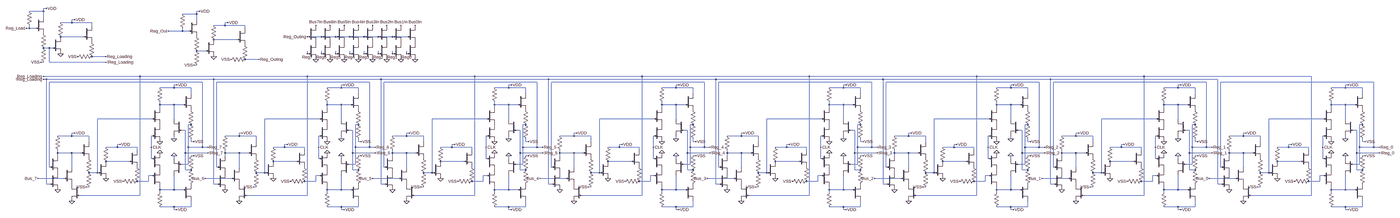
[diagram p0: schematic register_8bit.asc, whole sheet]
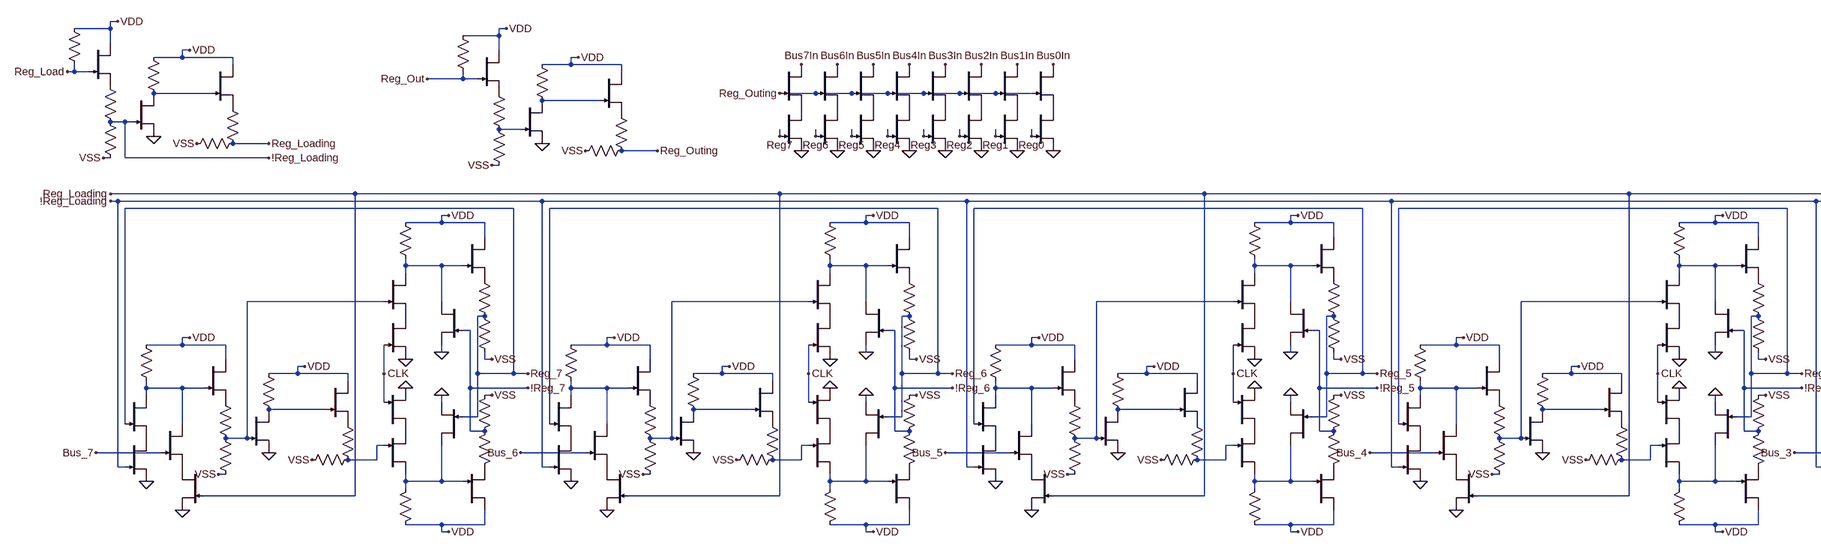
[diagram p1: schematic register_8bit.asc, part, row 1 of 1, column 1 of 2]
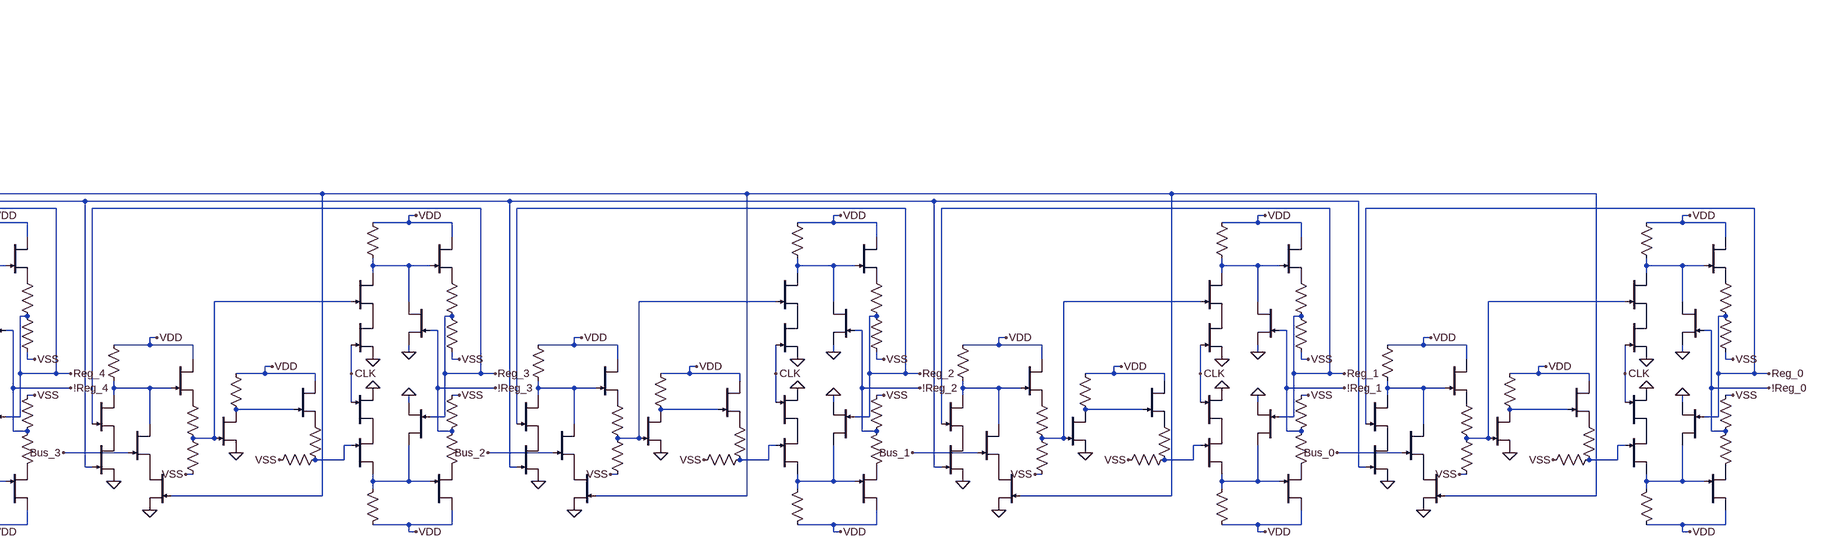
[diagram p2: schematic register_8bit.asc, part, row 1 of 1, column 2 of 2]
* register_8bit.asc
R1 VDD Reg_Load 100k
J_F1 VDD Reg_Load P001 DR
R2 P001 !Reg_Loading 1k
R3 !Reg_Loading VSS 4.8k
J_A1 N001 !Reg_Loading 0 DR
R4 VDD N001 50k
J_A2 VDD N001 P002 DR
R5 P002 Reg_Loading 1k
R6 Reg_Loading VSS 4.5k
R7 VDD Reg_Out 100k
J_F2 VDD Reg_Out P003 DR
R8 P003 N003 1k
R9 N003 VSS 4.8k
J_A3 N002 N003 0 DR
R10 VDD N002 50k
J_A4 VDD N002 P004 DR
R11 P004 Reg_Outing 1k
R12 Reg_Outing VSS 4.5k
J_A5 N004 N005 P005 DR
R13 VDD N004 100k
J_F3 VDD N004 P006 DR
R14 P006 Reg_7 1k
R15 Reg_7 VSS 4.8k
J_B1 N004 !Reg_7 0 DR
J_A6 N009 N008 P007 DR
R16 VDD N009 100k
J_F4 VDD N009 P008 DR
R17 P008 !Reg_7 1k
R18 !Reg_7 VSS 4.8k
J_B2 N009 Reg_7 0 DR
J_A7 P005 CLK 0 DR
J_A8 P007 CLK 0 DR
J_A9 N006 Reg_7 P009 DR
R19 VDD N006 100k
J_F5 VDD N006 P010 DR
R20 P010 N005 1k
R21 N005 VSS 4.8k
J_B3 N006 Bus_7 P011 DR
J_A10 N007 N005 0 DR
R22 VDD N007 50k
J_A11 VDD N007 P012 DR
R23 P012 N008 1k
R24 N008 VSS 4.5k
J_A12 P009 !Reg_Loading 0 DR
J_B4 P011 Reg_Loading 0 DR
J_A13 N010 N011 P013 DR
R25 VDD N010 100k
J_F6 VDD N010 P014 DR
R26 P014 Reg_6 1k
R27 Reg_6 VSS 4.8k
J_B5 N010 !Reg_6 0 DR
J_A14 N015 N014 P015 DR
R28 VDD N015 100k
J_F7 VDD N015 P016 DR
R29 P016 !Reg_6 1k
R30 !Reg_6 VSS 4.8k
J_B6 N015 Reg_6 0 DR
J_A15 P013 CLK 0 DR
J_A16 P015 CLK 0 DR
J_A17 N012 Reg_6 P017 DR
R31 VDD N012 100k
J_F8 VDD N012 P018 DR
R32 P018 N011 1k
R33 N011 VSS 4.8k
J_B7 N012 Bus_6 P019 DR
J_A18 N013 N011 0 DR
R34 VDD N013 50k
J_A19 VDD N013 P020 DR
R35 P020 N014 1k
R36 N014 VSS 4.5k
J_A20 P017 !Reg_Loading 0 DR
J_B8 P019 Reg_Loading 0 DR
J_A21 N016 N017 P021 DR
R37 VDD N016 100k
J_F9 VDD N016 P022 DR
R38 P022 Reg_5 1k
R39 Reg_5 VSS 4.8k
J_B9 N016 !Reg_5 0 DR
J_A22 N021 N020 P023 DR
R40 VDD N021 100k
J_F10 VDD N021 P024 DR
R41 P024 !Reg_5 1k
R42 !Reg_5 VSS 4.8k
J_B10 N021 Reg_5 0 DR
J_A23 P021 CLK 0 DR
J_A24 P023 CLK 0 DR
J_A25 N018 Reg_5 P025 DR
R43 VDD N018 100k
J_F11 VDD N018 P026 DR
R44 P026 N017 1k
R45 N017 VSS 4.8k
J_B11 N018 Bus_5 P027 DR
J_A26 N019 N017 0 DR
R46 VDD N019 50k
J_A27 VDD N019 P028 DR
R47 P028 N020 1k
R48 N020 VSS 4.5k
J_A28 P025 !Reg_Loading 0 DR
J_B12 P027 Reg_Loading 0 DR
J_A29 N022 N023 P029 DR
R49 VDD N022 100k
J_F12 VDD N022 P030 DR
R50 P030 Reg_4 1k
R51 Reg_4 VSS 4.8k
J_B13 N022 !Reg_4 0 DR
J_A30 N027 N026 P031 DR
R52 VDD N027 100k
J_F13 VDD N027 P032 DR
R53 P032 !Reg_4 1k
R54 !Reg_4 VSS 4.8k
J_B14 N027 Reg_4 0 DR
J_A31 P029 CLK 0 DR
J_A32 P031 CLK 0 DR
J_A33 N024 Reg_4 P033 DR
R55 VDD N024 100k
J_F14 VDD N024 P034 DR
R56 P034 N023 1k
R57 N023 VSS 4.8k
J_B15 N024 Bus_4 P035 DR
J_A34 N025 N023 0 DR
R58 VDD N025 50k
J_A35 VDD N025 P036 DR
R59 P036 N026 1k
R60 N026 VSS 4.5k
J_A36 P033 !Reg_Loading 0 DR
J_B16 P035 Reg_Loading 0 DR
J_A37 N028 N029 P037 DR
R61 VDD N028 100k
J_F15 VDD N028 P038 DR
R62 P038 Reg_3 1k
R63 Reg_3 VSS 4.8k
J_B17 N028 !Reg_3 0 DR
J_A38 N033 N032 P039 DR
R64 VDD N033 100k
J_F16 VDD N033 P040 DR
R65 P040 !Reg_3 1k
R66 !Reg_3 VSS 4.8k
J_B18 N033 Reg_3 0 DR
J_A39 P037 CLK 0 DR
J_A40 P039 CLK 0 DR
J_A41 N030 Reg_3 P041 DR
R67 VDD N030 100k
J_F17 VDD N030 P042 DR
R68 P042 N029 1k
R69 N029 VSS 4.8k
J_B19 N030 Bus_3 P043 DR
J_A42 N031 N029 0 DR
R70 VDD N031 50k
J_A43 VDD N031 P044 DR
R71 P044 N032 1k
R72 N032 VSS 4.5k
J_A44 P041 !Reg_Loading 0 DR
J_B20 P043 Reg_Loading 0 DR
J_A45 N034 N035 P045 DR
R73 VDD N034 100k
J_F18 VDD N034 P046 DR
R74 P046 Reg_2 1k
R75 Reg_2 VSS 4.8k
J_B21 N034 !Reg_2 0 DR
J_A46 N039 N038 P047 DR
R76 VDD N039 100k
J_F19 VDD N039 P048 DR
R77 P048 !Reg_2 1k
R78 !Reg_2 VSS 4.8k
J_B22 N039 Reg_2 0 DR
J_A47 P045 CLK 0 DR
J_A48 P047 CLK 0 DR
J_A49 N036 Reg_2 P049 DR
R79 VDD N036 100k
J_F20 VDD N036 P050 DR
R80 P050 N035 1k
R81 N035 VSS 4.8k
J_B23 N036 Bus_2 P051 DR
J_A50 N037 N035 0 DR
R82 VDD N037 50k
J_A51 VDD N037 P052 DR
R83 P052 N038 1k
R84 N038 VSS 4.5k
J_A52 P049 !Reg_Loading 0 DR
J_B24 P051 Reg_Loading 0 DR
J_A53 N040 N041 P053 DR
R85 VDD N040 100k
J_F21 VDD N040 P054 DR
R86 P054 Reg_1 1k
R87 Reg_1 VSS 4.8k
J_B25 N040 !Reg_1 0 DR
J_A54 N045 N044 P055 DR
R88 VDD N045 100k
J_F22 VDD N045 P056 DR
R89 P056 !Reg_1 1k
R90 !Reg_1 VSS 4.8k
J_B26 N045 Reg_1 0 DR
J_A55 P053 CLK 0 DR
J_A56 P055 CLK 0 DR
J_A57 N042 Reg_1 P057 DR
R91 VDD N042 100k
J_F23 VDD N042 P058 DR
R92 P058 N041 1k
R93 N041 VSS 4.8k
J_B27 N042 Bus_1 P059 DR
J_A58 N043 N041 0 DR
R94 VDD N043 50k
J_A59 VDD N043 P060 DR
R95 P060 N044 1k
R96 N044 VSS 4.5k
J_A60 P057 !Reg_Loading 0 DR
J_B28 P059 Reg_Loading 0 DR
J_A61 N046 N047 P061 DR
R97 VDD N046 100k
J_F24 VDD N046 P062 DR
R98 P062 Reg_0 1k
R99 Reg_0 VSS 4.8k
J_B29 N046 !Reg_0 0 DR
J_A62 N051 N050 P063 DR
R100 VDD N051 100k
J_F25 VDD N051 P064 DR
R101 P064 !Reg_0 1k
R102 !Reg_0 VSS 4.8k
J_B30 N051 Reg_0 0 DR
J_A63 P061 CLK 0 DR
J_A64 P063 CLK 0 DR
J_A65 N048 Reg_0 P065 DR
R103 VDD N048 100k
J_F26 VDD N048 P066 DR
R104 P066 N047 1k
R105 N047 VSS 4.8k
J_B31 N048 Bus_0 P067 DR
J_A66 N049 N047 0 DR
R106 VDD N049 50k
J_A67 VDD N049 P068 DR
R107 P068 N050 1k
R108 N050 VSS 4.5k
J_A68 P065 !Reg_Loading 0 DR
J_B32 P067 Reg_Loading 0 DR
J_BUS1 P069 Reg7 0 DR
J_BUS2 Bus7In Reg_Outing P069 DR
J_BUS3 P070 Reg6 0 DR
J_BUS4 Bus6In Reg_Outing P070 DR
J_BUS5 P071 Reg5 0 DR
J_BUS6 Bus5In Reg_Outing P071 DR
J_BUS7 P072 Reg4 0 DR
J_BUS8 Bus4In Reg_Outing P072 DR
J_BUS9 P073 Reg3 0 DR
J_BUS10 Bus3In Reg_Outing P073 DR
J_BUS11 P074 Reg2 0 DR
J_BUS12 Bus2In Reg_Outing P074 DR
J_BUS13 P075 Reg1 0 DR
J_BUS14 Bus1In Reg_Outing P075 DR
J_BUS15 P076 Reg0 0 DR
J_BUS16 Bus0In Reg_Outing P076 DR
.model NJF NJF
.model PJF PJF
.lib standard.jft
.backanno
.end